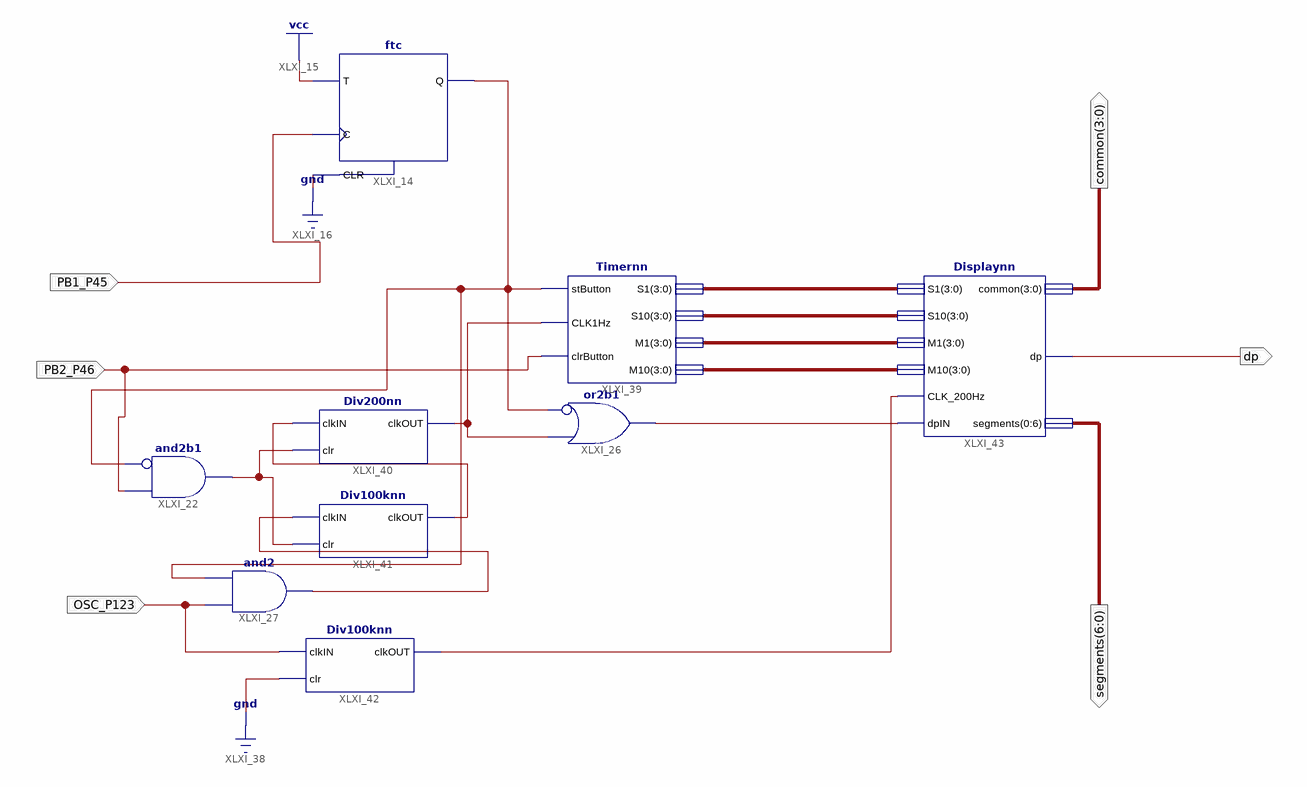
[diagram p0: schematic sheet 1]
// Xilinx ISE schematic Lab7.sch (spartan6) as structural Verilog: 9 symbols, 6 ports
module Lab7 (
  input  PB2_P46,
  input  OSC_P123,
  input  PB1_P45,
  output [3:0] common,
  output dp,
  output [6:0] segments
);

  wire XLXN_1, XLXN_3, XLXN_61, XLXN_72, XLXN_75, XLXN_79, XLXN_84;
  wire [3:0] XLXN_8, XLXN_9, XLXN_10, XLXN_11;

  ftc XLXI_14 (.C(PB1_P45), .CLR(1'b0), .T(1'b1), .Q(XLXN_84));
  or XLXI_26 (XLXN_61, ~XLXN_84, XLXN_3);  // or2b1
  and XLXI_27 (XLXN_72, XLXN_84, OSC_P123);
  and XLXI_22 (XLXN_79, ~XLXN_84, PB2_P46);  // and2b1
  Timernn XLXI_39 (
    .stButton(XLXN_84), .CLK1Hz(XLXN_3), .clrButton(PB2_P46), .M10(XLXN_11), .S1(XLXN_8), .S10(XLXN_9),
    .M1(XLXN_10));
  Div200nn XLXI_40 (.clkIN(XLXN_1), .clr(XLXN_79), .clkOUT(XLXN_3));
  Div100knn XLXI_41 (.clkIN(XLXN_72), .clr(XLXN_79), .clkOUT(XLXN_1));
  Div100knn XLXI_42 (.clkIN(OSC_P123), .clr(1'b0), .clkOUT(XLXN_75));
  Displaynn XLXI_43 (
    .S1(XLXN_8), .S10(XLXN_9), .M1(XLXN_10), .M10(XLXN_11), .CLK_200Hz(XLXN_75), .dpIN(XLXN_61),
    .common(common), .dp(dp), .segments(segments));
endmodule
